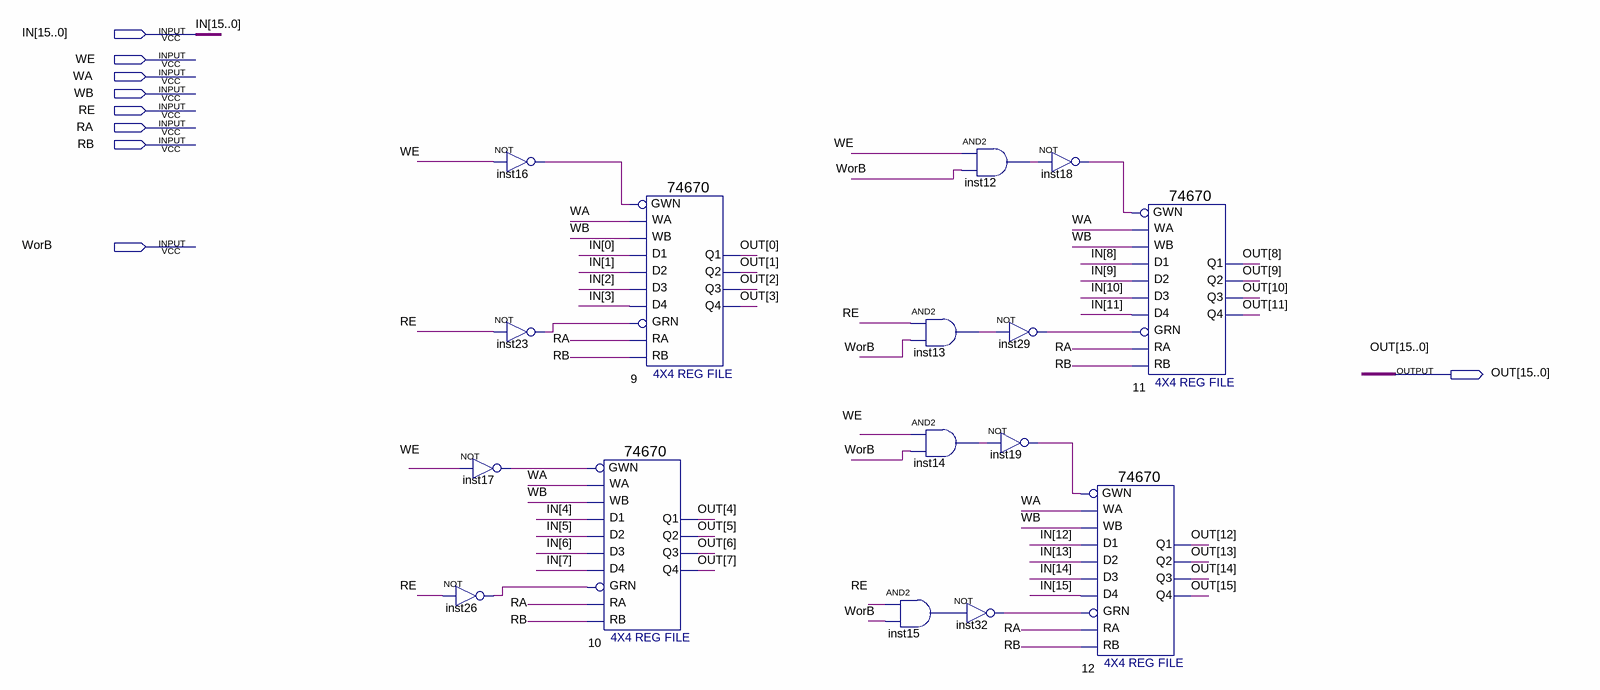
[diagram p0: schematic sheet]
// Quartus schematic REG1.bdf as structural Verilog: 16 symbols, 9 pins
module REG1 (
  input  [15:0] IN,
  input  WE,
  input  WA,
  input  WB,
  input  RE,
  input  RA,
  input  RB,
  input  WorB,
  output [15:0] OUT
);

  wire inst12_out, inst13_out, inst14_out, inst15_out, inst16_out, inst17_out, inst18_out, inst19_out,
       inst23_out, inst26_out, inst29_out, inst32_out;

  not inst17 (inst17_out, WE);
  not inst26 (inst26_out, RE);
  not inst16 (inst16_out, WE);
  not inst23 (inst23_out, RE);
  \74670  u_10 (
    .WA(WA), .WB(WB), .D1(IN[4]), .D2(IN[5]), .D3(IN[6]), .D4(IN[7]), .GRN(inst26_out), .RA(RA), .RB(RB),
    .GWN(inst17_out), .Q4(OUT[7]), .Q3(OUT[6]), .Q2(OUT[5]), .Q1(OUT[4]));
  \74670  u_9 (
    .WA(WA), .WB(WB), .D1(IN[0]), .D2(IN[1]), .D3(IN[2]), .D4(IN[3]), .GRN(inst23_out), .RA(RA), .RB(RB),
    .GWN(inst16_out), .Q4(OUT[3]), .Q3(OUT[2]), .Q2(OUT[1]), .Q1(OUT[0]));
  and inst15 (inst15_out, RE, WorB);
  and inst12 (inst12_out, WE, WorB);
  and inst13 (inst13_out, RE, WorB);
  and inst14 (inst14_out, WE, WorB);
  not inst32 (inst32_out, inst15_out);
  not inst29 (inst29_out, inst13_out);
  not inst19 (inst19_out, inst14_out);
  not inst18 (inst18_out, inst12_out);
  \74670  u_12 (
    .WA(WA), .WB(WB), .D1(IN[12]), .D2(IN[13]), .D3(IN[14]), .D4(IN[15]), .GRN(inst32_out), .RA(RA), .RB(RB),
    .GWN(inst19_out), .Q4(OUT[15]), .Q3(OUT[14]), .Q2(OUT[13]), .Q1(OUT[12]));
  \74670  u_11 (
    .WA(WA), .WB(WB), .D1(IN[8]), .D2(IN[9]), .D3(IN[10]), .D4(IN[11]), .GRN(inst29_out), .RA(RA), .RB(RB),
    .GWN(inst18_out), .Q4(OUT[11]), .Q3(OUT[10]), .Q2(OUT[9]), .Q1(OUT[8]));
endmodule
